# Altium schematic sheet POWER.SchDoc
size 420 x 297 mm; SheetNumber: 3; SheetTotal: 4
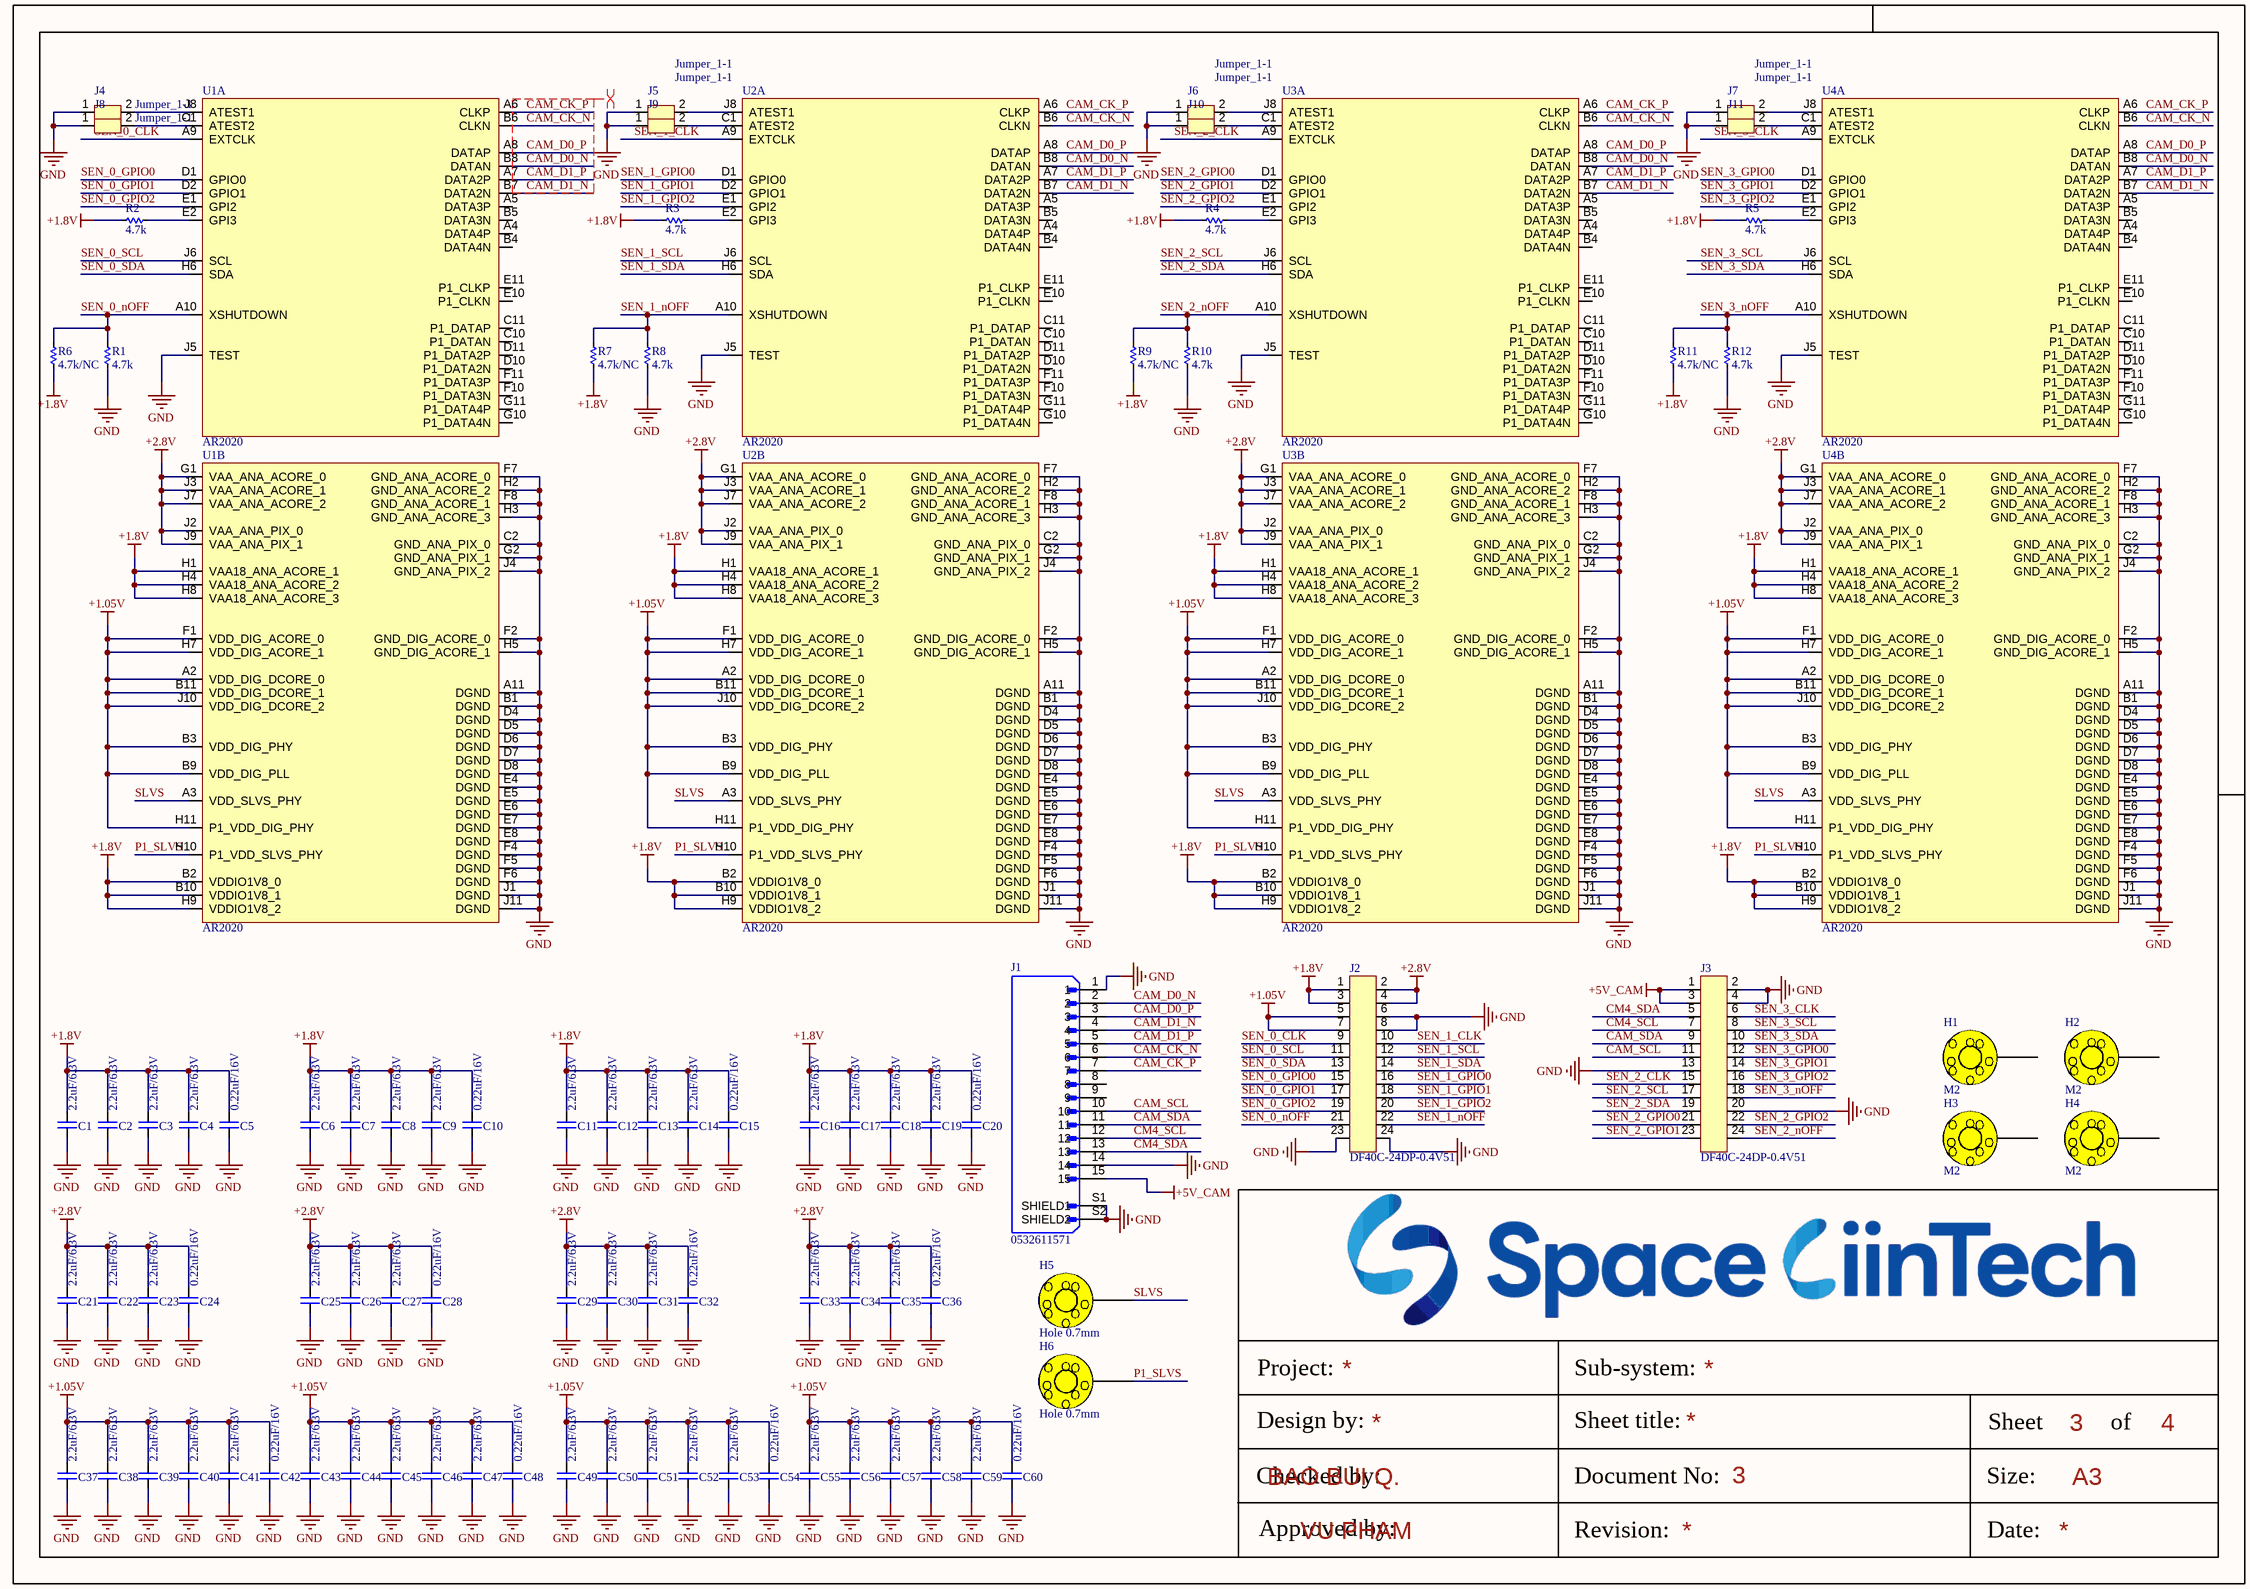
[diagram p0: POWER.SchDoc]

## Parts
C1  2.2uF/6.3V  [CAP_C_1005X60]
C2  2.2uF/6.3V  [CAP_C_1005X60]
C3  2.2uF/6.3V  [CAP_C_1005X60]
C4  2.2uF/6.3V  [CAP_C_1005X60]
C5  0.22uF/16V  [CAP_C_1005X60]
C6  2.2uF/6.3V  [CAP_C_1005X60]
C7  2.2uF/6.3V  [CAP_C_1005X60]
C8  2.2uF/6.3V  [CAP_C_1005X60]
C9  2.2uF/6.3V  [CAP_C_1005X60]
C10  0.22uF/16V  [CAP_C_1005X60]
C11  2.2uF/6.3V  [CAP_C_1005X60]
C12  2.2uF/6.3V  [CAP_C_1005X60]
C13  2.2uF/6.3V  [CAP_C_1005X60]
C14  2.2uF/6.3V  [CAP_C_1005X60]
C15  0.22uF/16V  [CAP_C_1005X60]
C16  2.2uF/6.3V  [CAP_C_1005X60]
C17  2.2uF/6.3V  [CAP_C_1005X60]
C18  2.2uF/6.3V  [CAP_C_1005X60]
C19  2.2uF/6.3V  [CAP_C_1005X60]
C20  0.22uF/16V  [CAP_C_1005X60]
C21  2.2uF/6.3V  [CAP_C_1005X60]
C22  2.2uF/6.3V  [CAP_C_1005X60]
C23  2.2uF/6.3V  [CAP_C_1005X60]
C24  0.22uF/16V  [CAP_C_1005X60]
C25  2.2uF/6.3V  [CAP_C_1005X60]
C26  2.2uF/6.3V  [CAP_C_1005X60]
C27  2.2uF/6.3V  [CAP_C_1005X60]
C28  0.22uF/16V  [CAP_C_1005X60]
C29  2.2uF/6.3V  [CAP_C_1005X60]
C30  2.2uF/6.3V  [CAP_C_1005X60]
C31  2.2uF/6.3V  [CAP_C_1005X60]
C32  0.22uF/16V  [CAP_C_1005X60]
C33  2.2uF/6.3V  [CAP_C_1005X60]
C34  2.2uF/6.3V  [CAP_C_1005X60]
C35  2.2uF/6.3V  [CAP_C_1005X60]
C36  0.22uF/16V  [CAP_C_1005X60]
C37  2.2uF/6.3V  [CAP_C_1005X60]
C38  2.2uF/6.3V  [CAP_C_1005X60]
C39  2.2uF/6.3V  [CAP_C_1005X60]
C40  2.2uF/6.3V  [CAP_C_1005X60]
C41  2.2uF/6.3V  [CAP_C_1005X60]
C42  0.22uF/16V  [CAP_C_1005X60]
C43  2.2uF/6.3V  [CAP_C_1005X60]
C44  2.2uF/6.3V  [CAP_C_1005X60]
C45  2.2uF/6.3V  [CAP_C_1005X60]
C46  2.2uF/6.3V  [CAP_C_1005X60]
C47  2.2uF/6.3V  [CAP_C_1005X60]
C48  0.22uF/16V  [CAP_C_1005X60]
C49  2.2uF/6.3V  [CAP_C_1005X60]
C50  2.2uF/6.3V  [CAP_C_1005X60]
C51  2.2uF/6.3V  [CAP_C_1005X60]
C52  2.2uF/6.3V  [CAP_C_1005X60]
C53  2.2uF/6.3V  [CAP_C_1005X60]
C54  0.22uF/16V  [CAP_C_1005X60]
C55  2.2uF/6.3V  [CAP_C_1005X60]
C56  2.2uF/6.3V  [CAP_C_1005X60]
C57  2.2uF/6.3V  [CAP_C_1005X60]
C58  2.2uF/6.3V  [CAP_C_1005X60]
C59  2.2uF/6.3V  [CAP_C_1005X60]
C60  0.22uF/16V  [CAP_C_1005X60]
H1  M2  [HEX-2.2mm]
H2  M2  [HEX-2.2mm]
H3  M2  [HEX-2.2mm]
H4  M2  [HEX-2.2mm]
H5  Hole 0.7mm  [HEX-0.7mm]
H6  Hole 0.7mm  [HEX-0.7mm]
J1  0532611571  [0532611571]
J2  DF40C-24DP-0.4V51  [CONN24_6p32X1p85]
J3  DF40C-24DP-0.4V51  [CONN24_6p32X1p85]
J4  Jumper_1-1  [Jumper_1-1]
J5  Jumper_1-1  [Jumper_1-1]
J6  Jumper_1-1  [Jumper_1-1]
J7  Jumper_1-1  [Jumper_1-1]
J8  Jumper_1-1  [Jumper_1-1]
J9  Jumper_1-1  [Jumper_1-1]
J10  Jumper_1-1  [Jumper_1-1]
J11  Jumper_1-1  [Jumper_1-1]
R1  4.7k  [RES_C_1005X40]
R2  4.7k  [RES_C_1005X40]
R3  4.7k  [RES_C_1005X40]
R4  4.7k  [RES_C_1005X40]
R5  4.7k  [RES_C_1005X40]
R6  4.7k/NC  [RES_C_1005X40]
R7  4.7k/NC  [RES_C_1005X40]
R8  4.7k  [RES_C_1005X40]
R9  4.7k/NC  [RES_C_1005X40]
R10  4.7k  [RES_C_1005X40]
R11  4.7k/NC  [RES_C_1005X40]
R12  4.7k  [RES_C_1005X40]
U1  AR2020  [BGA78C100P11X9_1300X1050X210]  (parts A,B of 2)
U2  AR2020  [BGA78C100P11X9_1300X1050X210]  (parts A,B of 2)
U3  AR2020  [BGA78C100P11X9_1300X1050X210]  (parts A,B of 2)
U4  AR2020  [BGA78C100P11X9_1300X1050X210]  (parts A,B of 2)

## Nets
+1.05V: C37.2 C38.2 C39.2 C40.2 C41.2 C42.2 C43.2 C44.2 C45.2 C46.2 C47.2 C48.2 C49.2 C50.2 C51.2 C52.2 C53.2 C54.2 C55.2 C56.2 C57.2 C58.2 C59.2 C60.2 J2.5 J2.7 U1.A2(VDD_DIG_DCORE_0) U1.B3(VDD_DIG_PHY) U1.B9(VDD_DIG_PLL) U1.B11(VDD_DIG_DCORE_1) U1.F1(VDD_DIG_ACORE_0) U1.H7(VDD_DIG_ACORE_1) U1.H11(P1_VDD_DIG_PHY) U1.J10(VDD_DIG_DCORE_2) U2.A2(VDD_DIG_DCORE_0) U2.B3(VDD_DIG_PHY) U2.B9(VDD_DIG_PLL) U2.B11(VDD_DIG_DCORE_1) U2.F1(VDD_DIG_ACORE_0) U2.H7(VDD_DIG_ACORE_1) U2.H11(P1_VDD_DIG_PHY) U2.J10(VDD_DIG_DCORE_2) U3.A2(VDD_DIG_DCORE_0) U3.B3(VDD_DIG_PHY) U3.B9(VDD_DIG_PLL) U3.B11(VDD_DIG_DCORE_1) U3.F1(VDD_DIG_ACORE_0) U3.H7(VDD_DIG_ACORE_1) U3.H11(P1_VDD_DIG_PHY) U3.J10(VDD_DIG_DCORE_2) U4.A2(VDD_DIG_DCORE_0) U4.B3(VDD_DIG_PHY) U4.B9(VDD_DIG_PLL) U4.B11(VDD_DIG_DCORE_1) U4.F1(VDD_DIG_ACORE_0) U4.H7(VDD_DIG_ACORE_1) U4.H11(P1_VDD_DIG_PHY) U4.J10(VDD_DIG_DCORE_2)
+1.8V: C1.2 C2.2 C3.2 C4.2 C5.2 C6.2 C7.2 C8.2 C9.2 C10.2 C11.2 C12.2 C13.2 C14.2 C15.2 C16.2 C17.2 C18.2 C19.2 C20.2 J2.1 J2.3 R2.1 R3.1 R4.1 R5.1 R6.1 R7.1 R9.1 R11.1 U1.B2(VDDIO1V8_0) U1.B10(VDDIO1V8_1) U1.H1(VAA18_ANA_ACORE_1) U1.H4(VAA18_ANA_ACORE_2) U1.H8(VAA18_ANA_ACORE_3) U1.H9(VDDIO1V8_2) U2.B2(VDDIO1V8_0) U2.B10(VDDIO1V8_1) U2.H1(VAA18_ANA_ACORE_1) U2.H4(VAA18_ANA_ACORE_2) U2.H8(VAA18_ANA_ACORE_3) U2.H9(VDDIO1V8_2) U3.B2(VDDIO1V8_0) U3.B10(VDDIO1V8_1) U3.H1(VAA18_ANA_ACORE_1) U3.H4(VAA18_ANA_ACORE_2) U3.H8(VAA18_ANA_ACORE_3) U3.H9(VDDIO1V8_2) U4.B2(VDDIO1V8_0) U4.B10(VDDIO1V8_1) U4.H1(VAA18_ANA_ACORE_1) U4.H4(VAA18_ANA_ACORE_2) U4.H8(VAA18_ANA_ACORE_3) U4.H9(VDDIO1V8_2)
+2.8V: C21.2 C22.2 C23.2 C24.2 C25.2 C26.2 C27.2 C28.2 C29.2 C30.2 C31.2 C32.2 C33.2 C34.2 C35.2 C36.2 J2.2 J2.4 U1.G1(VAA_ANA_ACORE_0) U1.J2(VAA_ANA_PIX_0) U1.J3(VAA_ANA_ACORE_1) U1.J7(VAA_ANA_ACORE_2) U1.J9(VAA_ANA_PIX_1) U2.G1(VAA_ANA_ACORE_0) U2.J2(VAA_ANA_PIX_0) U2.J3(VAA_ANA_ACORE_1) U2.J7(VAA_ANA_ACORE_2) U2.J9(VAA_ANA_PIX_1) U3.G1(VAA_ANA_ACORE_0) U3.J2(VAA_ANA_PIX_0) U3.J3(VAA_ANA_ACORE_1) U3.J7(VAA_ANA_ACORE_2) U3.J9(VAA_ANA_PIX_1) U4.G1(VAA_ANA_ACORE_0) U4.J2(VAA_ANA_PIX_0) U4.J3(VAA_ANA_ACORE_1) U4.J7(VAA_ANA_ACORE_2) U4.J9(VAA_ANA_PIX_1)
+5V_CAM: J1.15 J3.1 J3.3
GND: C1.1 C2.1 C3.1 C4.1 C5.1 C6.1 C7.1 C8.1 C9.1 C10.1 C11.1 C12.1 C13.1 C14.1 C15.1 C16.1 C17.1 C18.1 C19.1 C20.1 C21.1 C22.1 C23.1 C24.1 C25.1 C26.1 C27.1 C28.1 C29.1 C30.1 C31.1 C32.1 C33.1 C34.1 C35.1 C36.1 C37.1 C38.1 C39.1 C40.1 C41.1 C42.1 C43.1 C44.1 C45.1 C46.1 C47.1 C48.1 C49.1 C50.1 C51.1 C52.1 C53.1 C54.1 C55.1 C56.1 C57.1 C58.1 C59.1 C60.1 J1.1 J1.14 J1.S1(SHIELD1) J1.S2(SHIELD2) J2.6 J2.8 J2.23 J2.24 J3.2 J3.4 J3.13 J3.20 J4.1 J5.1 J6.1 J7.1 J8.1 J9.1 J10.1 J11.1 R1.2 R8.2 R10.2 R12.2 U1.A11(DGND) U1.B1(DGND) U1.C2(GND_ANA_PIX_0) U1.D4(DGND) U1.D5(DGND) U1.D6(DGND) U1.D7(DGND) U1.D8(DGND) U1.E4(DGND) U1.E5(DGND) U1.E6(DGND) U1.E7(DGND) U1.E8(DGND) U1.F2(GND_DIG_ACORE_0) U1.F4(DGND) U1.F5(DGND) U1.F6(DGND) U1.F7(GND_ANA_ACORE_0) U1.F8(GND_ANA_ACORE_1) U1.G2(GND_ANA_PIX_1) U1.H2(GND_ANA_ACORE_2) U1.H3(GND_ANA_ACORE_3) U1.H5(GND_DIG_ACORE_1) U1.J1(DGND) U1.J4(GND_ANA_PIX_2) U1.J5(TEST) U1.J11(DGND) U2.A11(DGND) U2.B1(DGND) U2.C2(GND_ANA_PIX_0) U2.D4(DGND) U2.D5(DGND) U2.D6(DGND) U2.D7(DGND) U2.D8(DGND) U2.E4(DGND) U2.E5(DGND) U2.E6(DGND) U2.E7(DGND) U2.E8(DGND) U2.F2(GND_DIG_ACORE_0) U2.F4(DGND) U2.F5(DGND) U2.F6(DGND) U2.F7(GND_ANA_ACORE_0) U2.F8(GND_ANA_ACORE_1) U2.G2(GND_ANA_PIX_1) U2.H2(GND_ANA_ACORE_2) U2.H3(GND_ANA_ACORE_3) U2.H5(GND_DIG_ACORE_1) U2.J1(DGND) U2.J4(GND_ANA_PIX_2) U2.J5(TEST) U2.J11(DGND) U3.A11(DGND) U3.B1(DGND) U3.C2(GND_ANA_PIX_0) U3.D4(DGND) U3.D5(DGND) U3.D6(DGND) U3.D7(DGND) U3.D8(DGND) U3.E4(DGND) U3.E5(DGND) U3.E6(DGND) U3.E7(DGND) U3.E8(DGND) U3.F2(GND_DIG_ACORE_0) U3.F4(DGND) U3.F5(DGND) U3.F6(DGND) U3.F7(GND_ANA_ACORE_0) U3.F8(GND_ANA_ACORE_1) U3.G2(GND_ANA_PIX_1) U3.H2(GND_ANA_ACORE_2) U3.H3(GND_ANA_ACORE_3) U3.H5(GND_DIG_ACORE_1) U3.J1(DGND) U3.J4(GND_ANA_PIX_2) U3.J5(TEST) U3.J11(DGND) U4.A11(DGND) U4.B1(DGND) U4.C2(GND_ANA_PIX_0) U4.D4(DGND) U4.D5(DGND) U4.D6(DGND) U4.D7(DGND) U4.D8(DGND) U4.E4(DGND) U4.E5(DGND) U4.E6(DGND) U4.E7(DGND) U4.E8(DGND) U4.F2(GND_DIG_ACORE_0) U4.F4(DGND) U4.F5(DGND) U4.F6(DGND) U4.F7(GND_ANA_ACORE_0) U4.F8(GND_ANA_ACORE_1) U4.G2(GND_ANA_PIX_1) U4.H2(GND_ANA_ACORE_2) U4.H3(GND_ANA_ACORE_3) U4.H5(GND_DIG_ACORE_1) U4.J1(DGND) U4.J4(GND_ANA_PIX_2) U4.J5(TEST) U4.J11(DGND)
CAM_CK_N: J1.6 U1.B6(CLKN) U2.B6(CLKN) U3.B6(CLKN) U4.B6(CLKN)
CAM_CK_P: J1.7 U1.A6(CLKP) U2.A6(CLKP) U3.A6(CLKP) U4.A6(CLKP)
CAM_D0_N: J1.2 U1.B8(DATAN) U2.B8(DATAN) U3.B8(DATAN) U4.B8(DATAN)
CAM_D0_P: J1.3 U1.A8(DATAP) U2.A8(DATAP) U3.A8(DATAP) U4.A8(DATAP)
CAM_D1_N: J1.4 U1.B7(DATA2N) U2.B7(DATA2N) U3.B7(DATA2N) U4.B7(DATA2N)
CAM_D1_P: J1.5 U1.A7(DATA2P) U2.A7(DATA2P) U3.A7(DATA2P) U4.A7(DATA2P)
CAM_SCL: J1.10 J3.11
CAM_SDA: J1.11 J3.9
CM4_SCL: J1.12 J3.7
CM4_SDA: J1.13 J3.5
P1_SLVS: H6.1 U1.H10(P1_VDD_SLVS_PHY) U2.H10(P1_VDD_SLVS_PHY) U3.H10(P1_VDD_SLVS_PHY) U4.H10(P1_VDD_SLVS_PHY)
SEN_0_CLK: J2.9 U1.A9(EXTCLK)
SEN_0_GPIO0: J2.15 U1.D1(GPIO0)
SEN_0_GPIO1: J2.17 U1.D2(GPIO1)
SEN_0_GPIO2: J2.19 U1.E1(GPI2)
SEN_0_nOFF: J2.21 R1.1 R6.2 U1.A10(XSHUTDOWN)
SEN_0_SCL: J2.11 U1.J6(SCL)
SEN_0_SDA: J2.13 U1.H6(SDA)
SEN_1_CLK: J2.10 U2.A9(EXTCLK)
SEN_1_GPIO0: J2.16 U2.D1(GPIO0)
SEN_1_GPIO1: J2.18 U2.D2(GPIO1)
SEN_1_GPIO2: J2.20 U2.E1(GPI2)
SEN_1_nOFF: J2.22 R7.2 R8.1 U2.A10(XSHUTDOWN)
SEN_1_SCL: J2.12 U2.J6(SCL)
SEN_1_SDA: J2.14 U2.H6(SDA)
SEN_2_CLK: J3.15 U3.A9(EXTCLK)
SEN_2_GPIO0: J3.21 U3.D1(GPIO0)
SEN_2_GPIO1: J3.23 U3.D2(GPIO1)
SEN_2_GPIO2: J3.22 U3.E1(GPI2)
SEN_2_nOFF: J3.24 R9.2 R10.1 U3.A10(XSHUTDOWN)
SEN_2_SCL: J3.17 U3.J6(SCL)
SEN_2_SDA: J3.19 U3.H6(SDA)
SEN_3_CLK: J3.6 U4.A9(EXTCLK)
SEN_3_GPIO0: J3.12 U4.D1(GPIO0)
SEN_3_GPIO1: J3.14 U4.D2(GPIO1)
SEN_3_GPIO2: J3.16 U4.E1(GPI2)
SEN_3_nOFF: J3.18 R11.2 R12.1 U4.A10(XSHUTDOWN)
SEN_3_SCL: J3.8 U4.J6(SCL)
SEN_3_SDA: J3.10 U4.H6(SDA)
SLVS: H5.1 U1.A3(VDD_SLVS_PHY) U2.A3(VDD_SLVS_PHY) U3.A3(VDD_SLVS_PHY) U4.A3(VDD_SLVS_PHY)
NetJ4_2: J4.2 U1.J8(ATEST1)
NetJ5_2: J5.2 U2.J8(ATEST1)
NetJ6_2: J6.2 U3.J8(ATEST1)
NetJ7_2: J7.2 U4.J8(ATEST1)
NetJ8_2: J8.2 U1.C1(ATEST2)
NetJ9_2: J9.2 U2.C1(ATEST2)
NetJ10_2: J10.2 U3.C1(ATEST2)
NetJ11_2: J11.2 U4.C1(ATEST2)
NetR2_2: R2.2 U1.E2(GPI3)
NetR3_2: R3.2 U2.E2(GPI3)
NetR4_2: R4.2 U3.E2(GPI3)
NetR5_2: R5.2 U4.E2(GPI3)

Not connected (* = marked no-connect by the designer): H1 1; H2 1; H3 1; H4 1; J1 8 9; U1 A4(DATA4P) A5(DATA3P) B4(DATA4N) B5(DATA3N) C10(P1_DATAN) C11(P1_DATAP) D10(P1_DATA2N) D11(P1_DATA2P) E10(P1_CLKN) E11(P1_CLKP) F10(P1_DATA3N) F11(P1_DATA3P) G10(P1_DATA4N) G11(P1_DATA4P); U2 A4(DATA4P) A5(DATA3P) B4(DATA4N) B5(DATA3N) C10(P1_DATAN) C11(P1_DATAP) D10(P1_DATA2N) D11(P1_DATA2P) E10(P1_CLKN) E11(P1_CLKP) F10(P1_DATA3N) F11(P1_DATA3P) G10(P1_DATA4N) G11(P1_DATA4P); U3 A4(DATA4P) A5(DATA3P) B4(DATA4N) B5(DATA3N) C10(P1_DATAN) C11(P1_DATAP) D10(P1_DATA2N) D11(P1_DATA2P) E10(P1_CLKN) E11(P1_CLKP) F10(P1_DATA3N) F11(P1_DATA3P) G10(P1_DATA4N) G11(P1_DATA4P); U4 A4(DATA4P) A5(DATA3P) B4(DATA4N) B5(DATA3N) C10(P1_DATAN) C11(P1_DATAP) D10(P1_DATA2N) D11(P1_DATA2P) E10(P1_CLKN) E11(P1_CLKP) F10(P1_DATA3N) F11(P1_DATA3P) G10(P1_DATA4N) G11(P1_DATA4P)

## Layout directives
differential pair; net class DIFF100: CAM_CK_N, CAM_CK_P, CAM_D0_N, CAM_D0_P, CAM_D1_N, CAM_D1_P

## Notes on the sheet
- Project:
- Sub-system:
- Design by:
- BAO BUI Q.
- Sheet title:
- Sheet
- A3
- of
- Checked by:
- Approved by:
- VU PHAM
- Revision:
- Document No:
- Size:
- Date:

## Library data of the parts
C1-C60 = CAP_SMD: CAP_Chip; Value: 33pF
H1-H6 = HEX-M3
J1 = CONN_SMD_15: Conn Shrouded Header (4 Sides) HDR 15 POS 1.25mm Solder RA Side Entry SMD PicoBladeâ„¢ T/R; MF: Molex; Package: None; MP: 532611571; Check_prices: https://www.snapeda.com/parts/532611571/Molex/view-part/?ref=eda; Purchase-URL: https://pricing.snapeda.com/search/part/532611571/?ref=eda; Value: *; Availability: In Stock; Price: None; SnapEDA_Link: https://www.snapeda.com/parts/532611571/Molex/view-part/?ref=snap
J2 J3 = DF40C-24DP-0.4V51: No Description Available; Mfr_Name: Hirose; RefDes: RefDes; Type: Type
J4-J11 = Jumper_1_1
R1-R12 = RES-SMD: RES-Chip; Manufacturer: Generic Components; Class: Passive; Published: 08/06/2000; Publisher: Altium Hobart Technology Centre